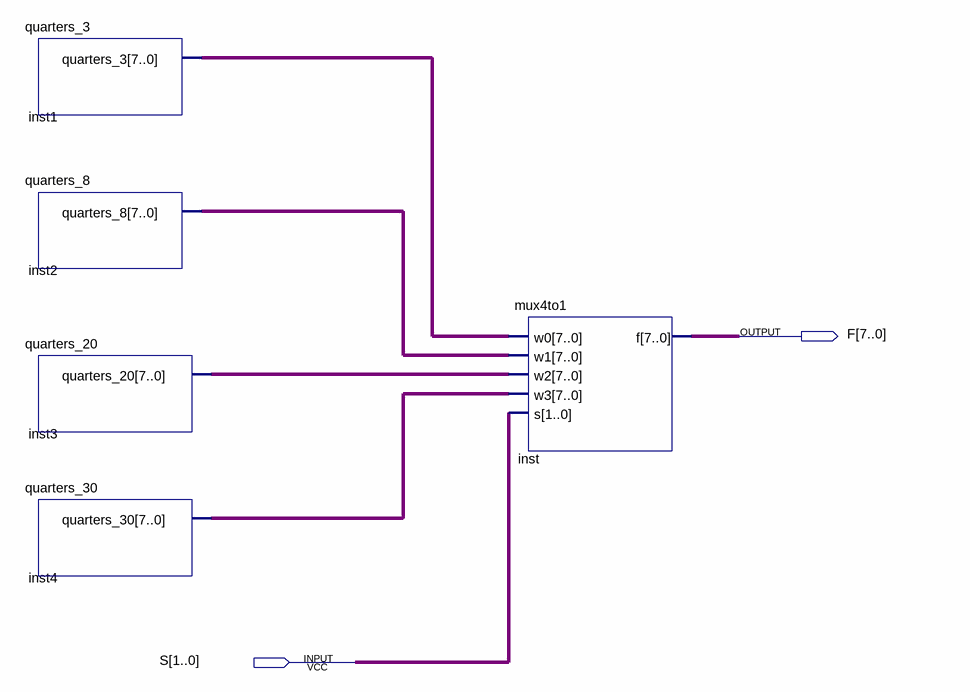
[diagram p0: schematic sheet]
// Quartus schematic items_mux.bdf as structural Verilog: 5 symbols, 2 pins
module items_mux (
  input  [1:0] S,
  output [7:0] F
);

  wire [7:0] inst1_quarters_3, inst2_quarters_8, inst3_quarters_20, inst4_quarters_30;

  quarters_3 inst1 (.quarters_3(inst1_quarters_3));
  quarters_8 inst2 (.quarters_8(inst2_quarters_8));
  quarters_20 inst3 (.quarters_20(inst3_quarters_20));
  quarters_30 inst4 (.quarters_30(inst4_quarters_30));
  mux4to1 inst (
    .w0(inst1_quarters_3), .w1(inst2_quarters_8), .w2(inst3_quarters_20), .w3(inst4_quarters_30), .s(S), .f(F));
endmodule
